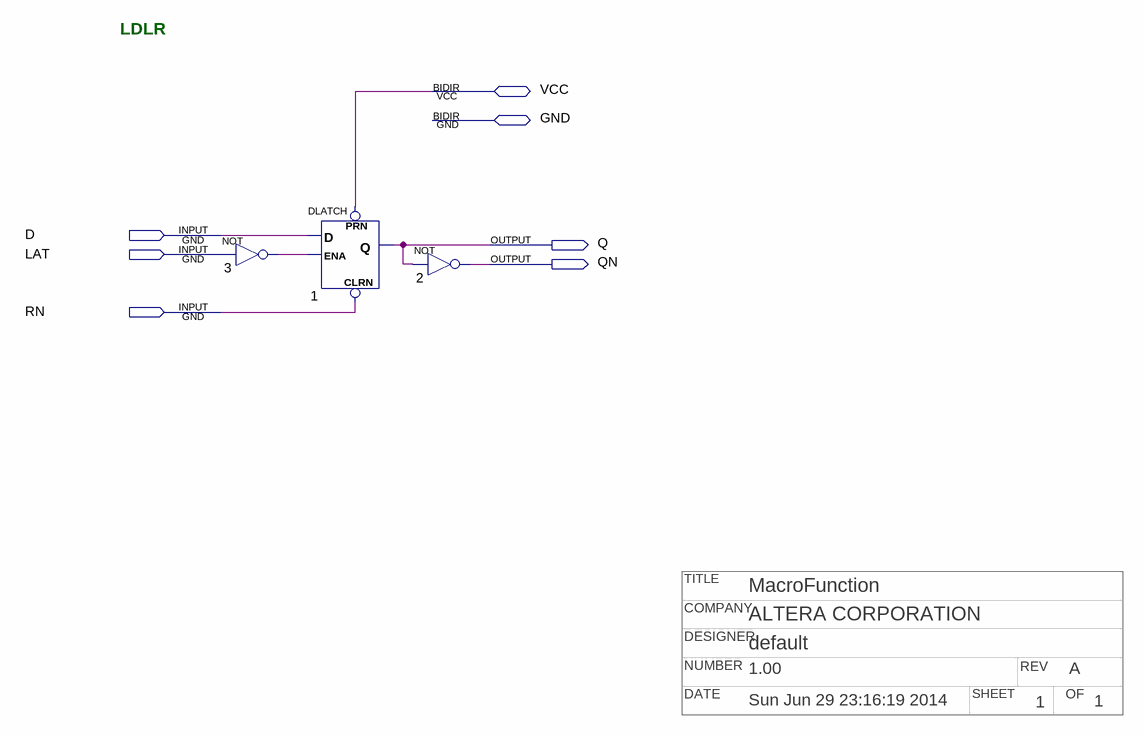
[diagram p0: schematic sheet]
// Quartus schematic npldlr.bdf as structural Verilog: 3 symbols, 7 pins
// Title block: TITLE: MacroFunction; COMPANY: ALTERA CORPORATION; DESIGNER: default; NUMBER: 1.00; REV: A; DATE: Sun Jun 29 23:16:19 2014; SHEET: 1; OF: 1
module npldlr (
  input  D,
  input  LAT,
  input  RN,
  inout  VCC,
  inout  GND,
  output Q,
  output QN
);

  wire n3_out;

  not u_3 (n3_out, LAT);
  DLATCH u_1 (.CLRN(RN), .D(D), .ENA(n3_out), .PRN(VCC), .Q(Q));
  not u_2 (QN, Q);

  // Notes on the sheet:
  //   LDLR
endmodule
